# Altium schematic sheet power_unit.SchDoc: Power filtering circuit
size A4; Date: 30.05.2015; Author: Grzegorz Gajoch; DocumentNumber: 2; SheetNumber: 2; SheetTotal: 9; Model: EM1; PageSetup: Record=PageOptions|CenterHorizontal=True|CenterVertical=True|PrintScale=0.52|XCorrection=1.00|YCorrection=1.00|PrintKind=1|BorderSize=5000000|LeftOffset=0|BottomOffset=0|Orientation=2|PaperLength=4200|PaperWidth=2970|Scale=100|PaperSource=7|PrintQuality=600|MediaType=1|DitherType=10|PaperKind=A3|PrintScaleMode=1
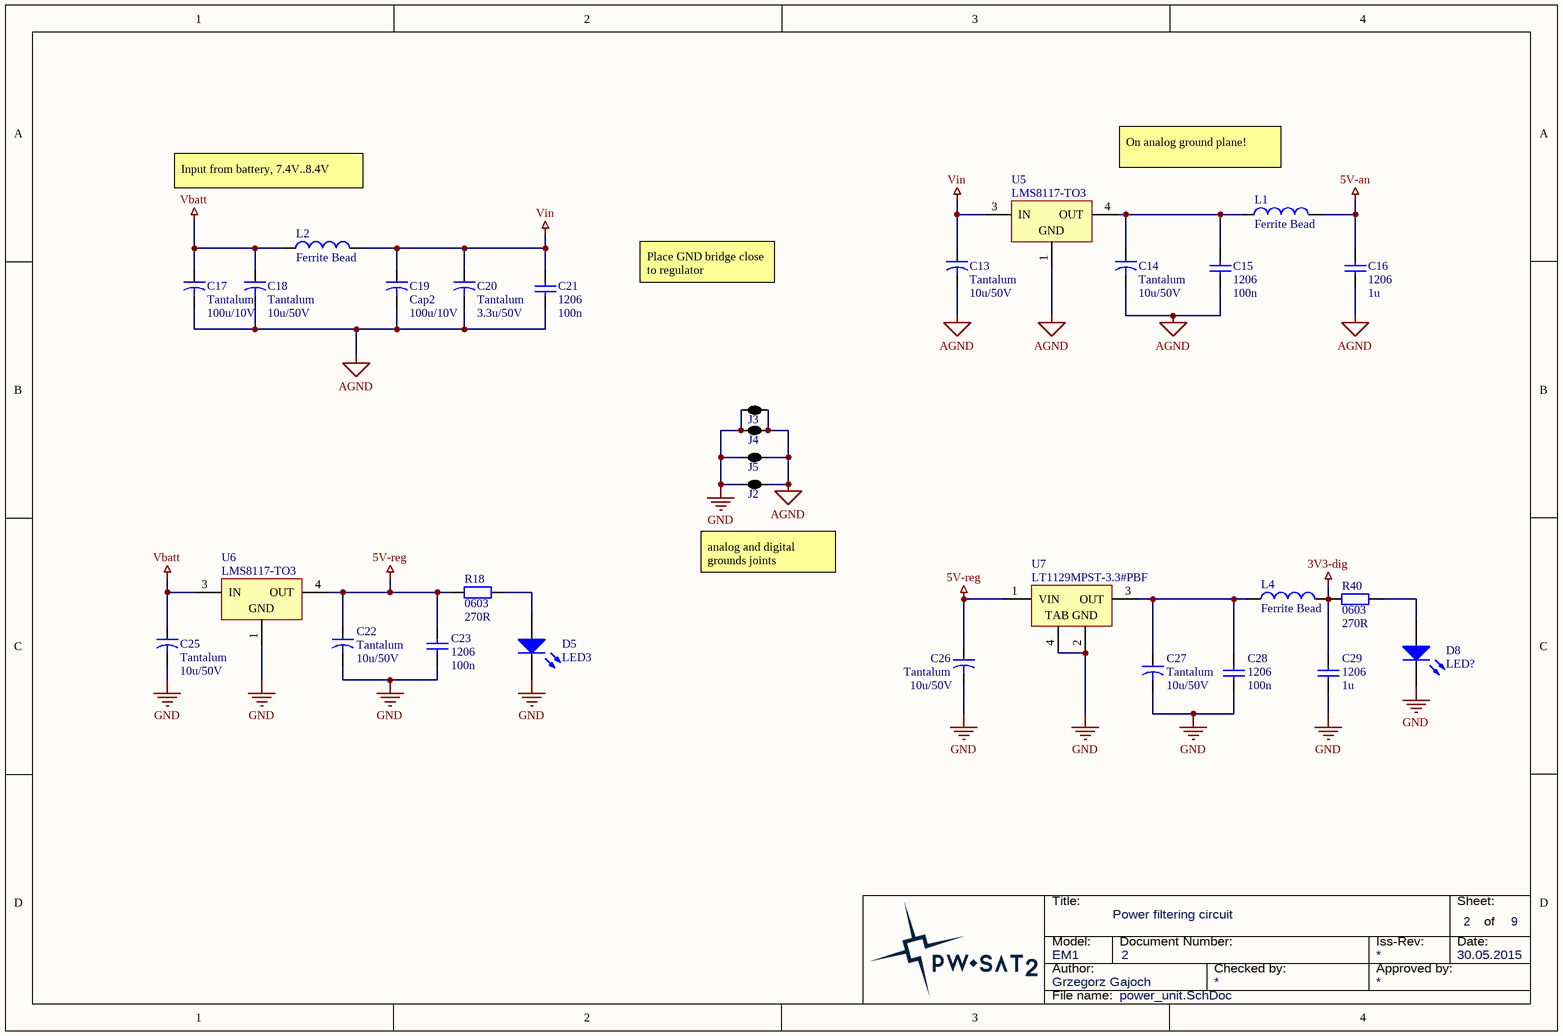
[diagram p0: power_unit.SchDoc]

## Parts
C13  Tantalum  value 10u/50V  [Tantalum_cap_D]
C14  Tantalum  value 10u/50V  [Tantalum_cap_D]
C15  1206  value 100n  [SMD_Capacitor_1206]
C16  1206  value 1u  [SMD_Capacitor_1206]
C17  Tantalum  value 100u/10V  [Tantalum_cap_D]
C18  Tantalum  value 10u/50V  [Tantalum_cap_D]
C19  Cap2  value 100u/10V  [Tantalum_cap_D]
C20  Tantalum  value 3.3u/50V  [Tantalum_cap_D]
C21  1206  value 100n  [SMD_Capacitor_1206]
C22  Tantalum  value 10u/50V  [Tantalum_cap_D]
C23  1206  value 100n  [SMD_Capacitor_1206]
C25  Tantalum  value 10u/50V  [Tantalum_cap_D]
C26  Tantalum  value 10u/50V  [Tantalum_cap_D]
C27  Tantalum  value 10u/50V  [Tantalum_cap_D]
C28  1206  value 100n  [SMD_Capacitor_1206]
C29  1206  value 1u  [SMD_Capacitor_1206]
D5  LED3  [LED 0805 RED]
D8  LED?  [LED 0805 RED]
J2  2 way net tie junction  [2way_MP]  (value not drawn)  (net tie, no BOM)
J3  2 way net tie junction  [2way_MP]  (value not drawn)  (net tie, no BOM)
J4  2 way net tie junction  [2way_MP]  (value not drawn)  (net tie, no BOM)
J5  2 way net tie junction  [2way_MP]  (value not drawn)  (net tie, no BOM)
L1  Ferrite Bead  [Ferrite 1206]
L2  Ferrite Bead  [Ferrite 1206]
L4  Ferrite Bead  [Ferrite 1206]
R18  0603  value 270R  [SMD_Resistor_0603]
R40  0603  value 270R  [SMD_Resistor_0603]
U5  LMS8117-TO3  [TD03B_M]
U6  LMS8117-TO3  [TD03B_M]
U7  LT1129MPST-3.3#PBF  [LT-ST-3-SOT-223_N]

## Nets
3V3-dig: C29.2 L4.2 R40.2
5V-an: C16.2 L1.2
5V-reg: C22.1 C23.2 C26.1 R18.2 U6.4(OUT) U7.1(VIN)
AGND: C13.2 C14.2 C15.1 C16.1 C17.2 C18.2 C19.2 C20.2 C21.1 J2.2 J3.2 J4.2 J5.2 U5.1(GND)
GND: C22.2 C23.1 C25.2 C26.2 C27.2 C28.1 C29.1 D5.2(K) D8.2(K) J2.1 J3.1 J4.1 J5.1 U6.1(GND) U7.2(GND) U7.4(TAB)
Vbatt: C17.1 C18.1 C25.1 L2.1 U6.3(IN)
Vin: C13.1 C19.1 C20.1 C21.2 L2.2 U5.3(IN)
NetC14_1: C14.1 C15.2 L1.1 U5.4(OUT)
NetC27_1: C27.1 C28.2 L4.1 U7.3(OUT)
NetD5_1: D5.1(A) R18.1
NetD8_1: D8.1(A) R40.1

## Notes on the sheet
- On analog ground plane!
- Input from battery, 7.4V..8.4V
- Place GND bridge close to regulator
- analog and digital grounds joints
- Title:
- Sheet:
- of
- Author:
- Model:
- Document Number:
- Checked by:
- Iss-Rev:
- Approved by:
- Date:
- File name:

## Library data of the parts
C13 C14 C17-C20 C22 C25-C27 = Cap2: Capacitor; Published: 23-Sep-2002; PackageReference: CAPR5-4X5; Publisher: Altium Limited; PackageDescription: Capacitor; 2 Leads
C15 C16 C21 C23 C28 C29 = Cap: Capacitor; Published: 8-Jun-2000; LatestRevisionDate: 17-Jul-2002; LatestRevisionNote: Re-released for DXP Platform.; PackageReference: RAD-0.3; Publisher: Altium Limited; PackageDescription: Radial Cap, Thru-Hole; 2 Leads; 0.3 in Pin Spacing
D5 D8 = LED3: Typical BLUE SiC LED; Published: 8-Jun-2000; LatestRevisionDate: 17-Dec-2003; LatestRevisionNote: PCB Footprint replaced.; DatasheetVersion: 16-Apr-2002; PackageVersion: 16-Apr-2002; PackageReference: 3.5X2.8X1.9; Publisher: Altium Limited; PackageDescription: SM LED; 2 C-Bend Leads; Body 3.5 x 2.8 x 1.9 mm, inc leads (LxWxH typ)
J2-J5 = 2way: ComponentLink1URL: http://www.edatools.cz/addons; ComponentLink1Description: Source; FootprintNote: LP=12mil, MP=40mil, HP=120mil
L1 L2 L4 = Inductor: Code_IEC: 1005; Published: 8-Jun-2000; LatestRevisionDate: 29-May-2009; LatestRevisionNote: IPC-7351 Footprint Added.; PackageReference: 0402-A; Publisher: Altium Limited; PackageDescription: Chip Inductor; Code_JEITA: 0402
R18 R40 = Res2: Resistor; Published: 8-Jun-2000; LatestRevisionDate: 17-Jul-2002; LatestRevisionNote: Re-released for DXP Platform.; PackageReference: AXIAL-0.4; Publisher: Altium Limited; PackageDescription: Axial Device, Thru-Hole; 2 Leads; 0.4 in Pin Spacing
U7 = LT1129MPST-3.3#PBF: Micropower Low Dropout Regulator with Shutdown, 4.15 to 30 V Vin, 3.3 V Vout, 3-pin SOT223 (ST-3), -55 to 125 degC, Pb-Free; Manufacturer: Linear Technology; Discrete Pass Element: no; Dropout Voltage(V): 0.45; Iout(mA): 700; Isupply(mA): 0.05; Number of Outputs: 1; Output Voltage: 3.3 V; PSRR(dB): 64; Shutdown Current(uA): 16; Vin Max(V): 30; Vin Min(V): 4.15; DatasheetVersion: Rev. F; PackageVersion: Jun-10; PackageReference: ST-3; PackageDescription: 3-Pin Plastic SOT-223, 3.505 x 6.505 mm Body, Pitch 2.3 mm; Supplier 1: Digi-Key; Supplier Part Number 1: LT1129MPST-3.3#PBF-ND; RoHS: TRUE; Mounting Technology: Surface Mount; PartNumber: LT1129MPST-3.3#PBF; ComponentLink1Description: Manufacturer URL; ComponentLink1URL: http://www.linear.com/; ComponentLink2Description: Datasheet; ComponentLink2URL: http://cds.linear.com/docs/en/datasheet/112935ff.pdf; ComponentLink3Description: Package Specification; ComponentLink3URL: http://cds.linear.com/docs/en/packaging/SOT_3_05-08-1630.pdf